# Altium schematic sheet MAX6675.SchDoc
size A4
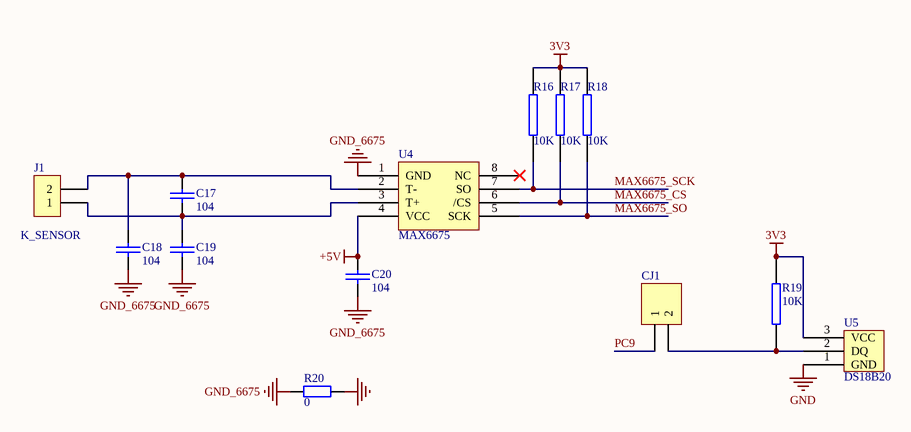
[diagram p0: MAX6675.SchDoc]

## Parts
C17  104  [1206]
C18  104  [1206]
C19  104  [1206]
C20  104  [1206]
CJ1  DS18B20  [HDR1X2]  (value not drawn)
J1  K_SENSOR  [OUT_CJ]
R16  10K  [1206]
R17  10K  [1206]
R18  10K  [1206]
R19  10K  [1206]
R20  0  [1206]
U4  MAX6675  [SO-8]
U5  DS18B20  [DS18B20]

## Nets
3V3: R16.2 R17.2 R18.2 R19.2 U5.3(VCC)
+5V: C20.1 U4.4(VCC)
GND: R20.2 U5.1(GND)
GND_6675: C18.2 C19.2 C20.2 R20.1 U4.1(GND)
MAX6675_CS: R17.1 U4.6(/CS)
MAX6675_SCK: R16.1 U4.7(SO)
MAX6675_SO: R18.1 U4.5(SCK)
PC9: CJ1.1
NetC17_1: C17.1 C18.1 J1.2 U4.2(T-)
NetC17_2: C17.2 C19.1 J1.1 U4.3(T+)
NetCJ1_2: CJ1.2 R19.1 U5.2(DQ)

Not connected (* = marked no-connect by the designer): U4 8(NC)*

## Library data of the parts
C17-C20 = 普通电容: Capacitor
CJ1 = Header 2: Header, 2-Pin; LatestRevisionDate: 17-Jul-2002; LatestRevisionNote: Re-released for DXP Platform.; Publisher: Altium Limited
J1 = CON2: Connector
R16-R19 = RES2
R20 = Res2: Resistor; Value: 10K; Published: 8-Jun-2000; LatestRevisionDate: 17-Jul-2002; LatestRevisionNote: Re-released for DXP Platform.; PackageReference: AXIAL-0.4; Publisher: Altium Limited; PackageDescription: Axial Device, Thru-Hole; 2 Leads; 0.4 in Pin Spacing